# EAGLE design main (EAGLE 8.0.1)
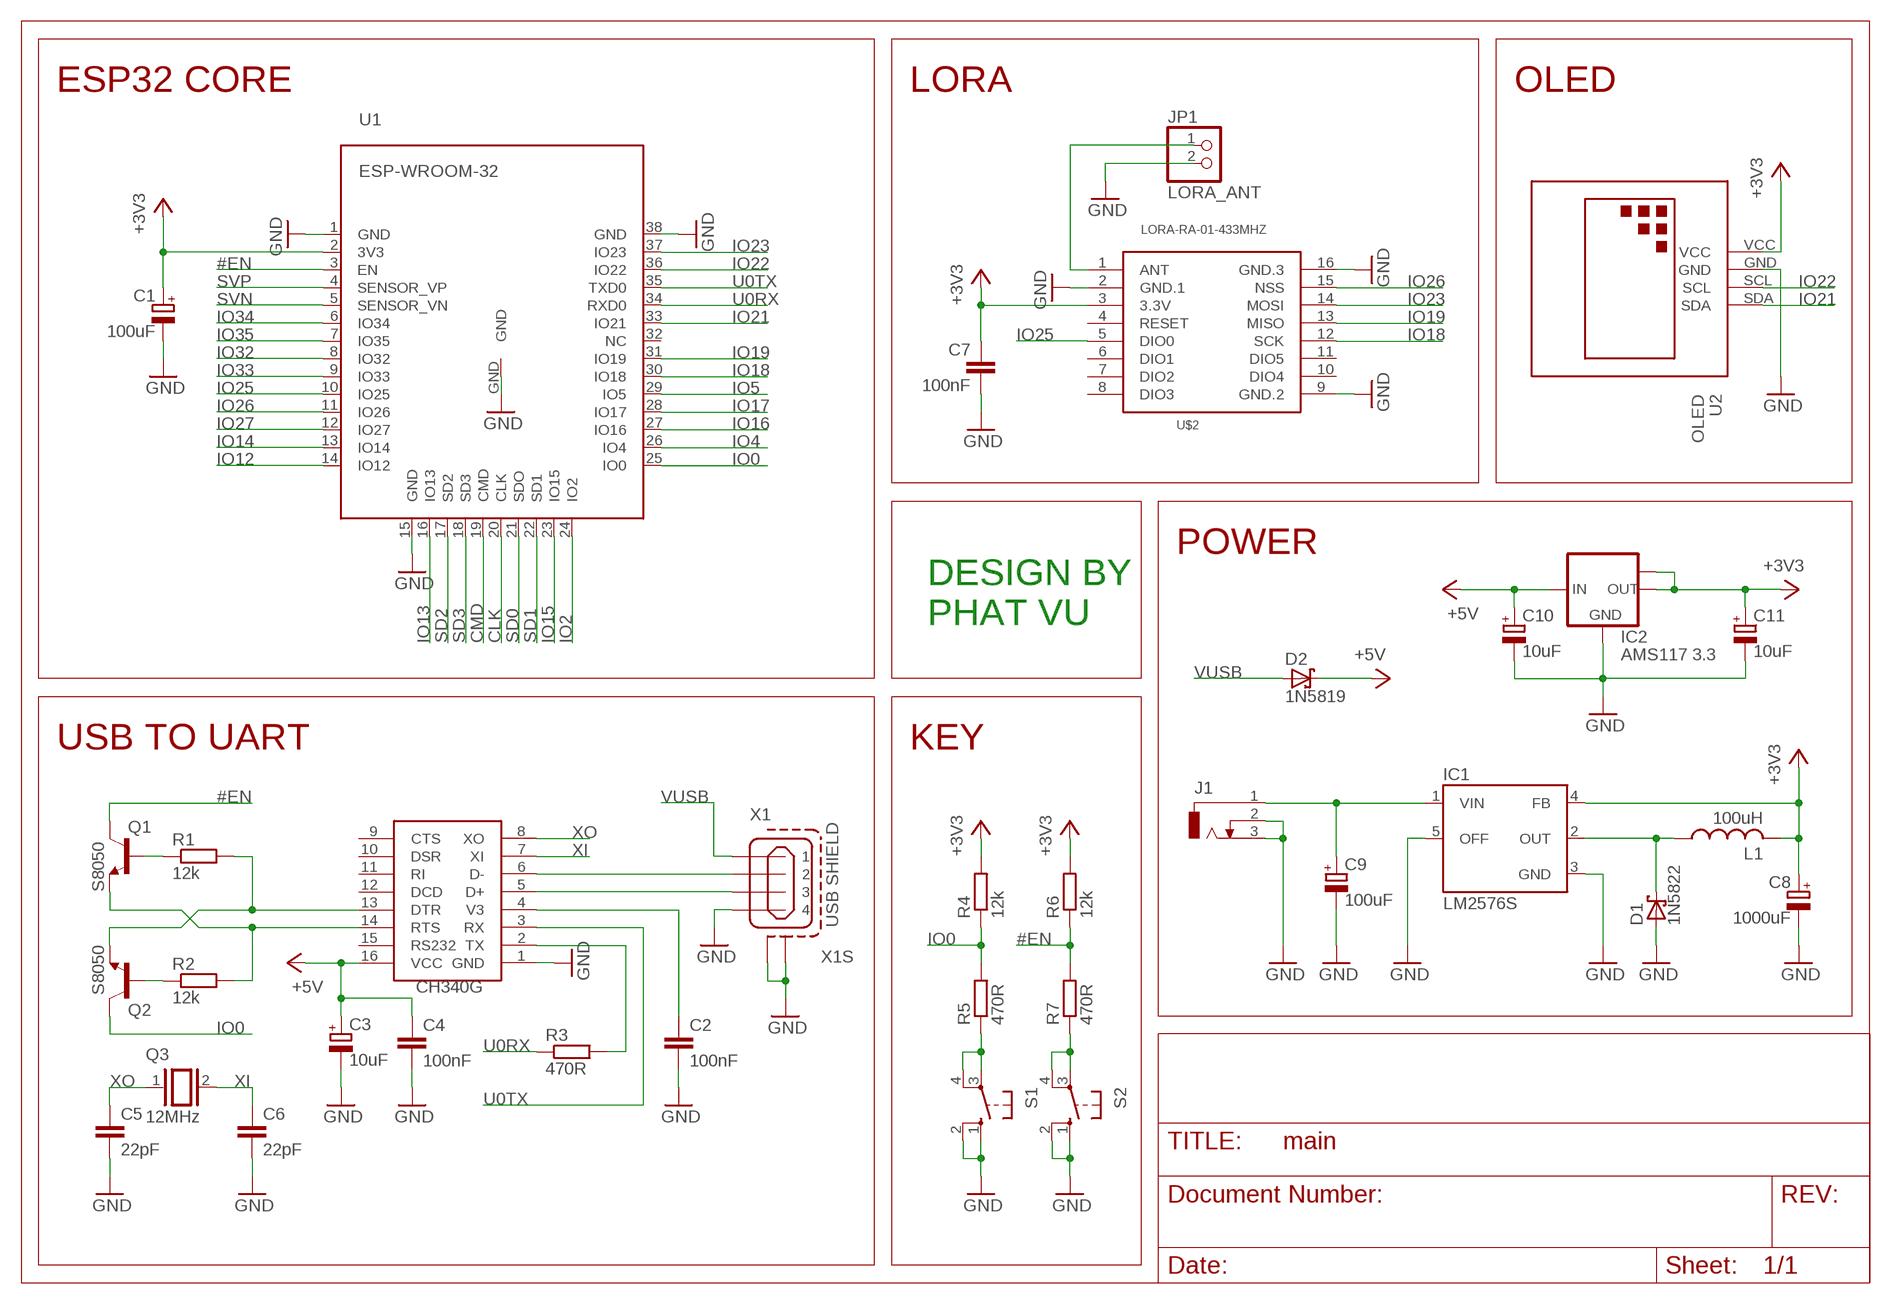
[diagram p0: schematic, sheet 1]

## Parts
C1  100uF  CPOL-EUE5-10.5  [E5-10,5]
C2  100nF  C-EU050-024X044  [C050-024X044]
C3  10uF  CPOL-EUE2.5-6  [E2,5-6]
C4  100nF  C-EU050-024X044  [C050-024X044]
C5  22pF  C-EU050-024X044  [C050-024X044]
C6  22pF  C-EU050-024X044  [C050-024X044]
C7  100nF  C-EU050-024X044  [C050-024X044]
C8  1000uF  CPOL-EUE5-13  [E5-13]
C9  100uF  CPOL-EUE5-10.5  [E5-10,5]
C10  10uF  CPOL-EUE2.5-6  [E2,5-6]
C11  10uF  CPOL-EUE2.5-6  [E2,5-6]
D1  1N5822  SCHOTTKY-DIODEDO201T15  [DO201T15]
D2  1N5819  1N5819-B  [DO41-7.6]
IC1  LM2576S  [TO263-5]
IC2  AMS117 3.3  LM1117MPX-3.3  [SOT223]
J1  DCJ0303  [DCJ0303]
JP1  LORA_ANT  PINHD-1X2  [1X02]
L1  100uH  L-US6000-XXX-RC  [6000-XXXX-RC]
Q1  S8050  S8050TO92  [TO92-EBC]
Q2  S8050  S8050TO92  [TO92-EBC]
Q3  12MHz  XTAL/S  [QS]
R1  12k  R-EU_0207/10  [0207/10]
R2  12k  R-EU_0207/10  [0207/10]
R3  470R  R-EU_0207/10  [0207/10]
R4  12k  R-EU_0207/10  [0207/10]
R5  470R  R-EU_0207/10  [0207/10]
R6  12k  R-EU_0207/10  [0207/10]
R7  470R  R-EU_0207/10  [0207/10]
S1  10-XX  [B3F-10XX]
S2  10-XX  [B3F-10XX]
U1  ESP-WROOM-32  [ESP-WROOM-32]
U2  OLED  OLED-096-I2C  [OLED-096-I2C]
U$1  CH340G  [SOIC16]
U$2  LORA-RA-01-433MHZ  [LORA-RA1-SMD]
X1  USB SHIELD  MINI-USB_SHIELD4P-85-32004-00X  [85-32004-00X]

## Nets
#EN: Q1.C R6.1 R7.2 U1.3(EN)
+3V3: C1.+ C7.1 C8.+ C11.+ IC1.4(FB) IC2.2(OUT) IC2.TAB(OUT1) L1.2 R4.2 R6.2 U1.2(3V3) U2.VCC U$2.3(3.3V)
+5V: C3.+ C4.1 C10.+ D2.C IC2.3(IN) U$1.16(VCC)
CLK: U1.20(CLK)
CMD: U1.19(CMD)
GND: C1.- C2.2 C3.- C4.2 C5.2 C6.2 C7.2 C8.- C9.- C10.- C11.- D1.A IC1.3(GND) IC1.5(OFF) IC2.1(GND) J1.2 J1.3 JP1.2 S1.1(S) S1.2(S1) S2.1(S) S2.2(S1) U1.1(GND) U1.15(GND) U1.38(GND) U1.GND U2.GND U$1.1(GND) U$2.2(GND.1) U$2.9(GND.2) U$2.16(GND.3) X1.4 X1.M1(S1) X1.M2(S2)
IO0: Q2.C R4.1 R5.2 U1.25(IO0)
IO2: U1.24(IO2)
IO4: U1.26(IO4)
IO5: U1.29(IO5)
IO12: U1.14(IO12)
IO13: U1.16(IO13)
IO14: U1.13(IO14)
IO15: U1.23(IO15)
IO16: U1.27(IO16)
IO17: U1.28(IO17)
IO18: U1.30(IO18) U$2.12(SCK)
IO19: U1.31(IO19) U$2.13(MISO)
IO21: U1.33(IO21) U2.SDA
IO22: U1.36(IO22) U2.SCL
IO23: U1.37(IO23) U$2.14(MOSI)
IO25: U1.10(IO25) U$2.5(DIO0)
IO26: U1.11(IO26) U$2.15(NSS)
IO27: U1.12(IO27)
IO32: U1.8(IO32)
IO33: U1.9(IO33)
IO34: U1.6(IO34)
IO35: U1.7(IO35)
N$1: JP1.1 U$2.1(ANT)
N$2: R3.2 U$1.2(TX)
N$3: U$1.6(D-) X1.2
N$4: U$1.5(D+) X1.3
N$5: C2.1 U$1.4(V3)
N$6: Q1.E R2.2 U$1.14(RTS)
N$7: Q2.E R1.2 U$1.13(DTR)
N$8: C9.+ IC1.1(VIN) J1.1
N$9: Q2.B R2.1
N$10: Q1.B R1.1
N$11: R7.1 S2.3(P) S2.4(P1)
N$12: R5.1 S1.3(P) S1.4(P1)
N$13: D1.C IC1.2(OUT) L1.1
SD0: U1.21(SDO)
SD1: U1.22(SD1)
SD2: U1.17(SD2)
SD3: U1.18(SD3)
SVN: U1.5(SENSOR_VN)
SVP: U1.4(SENSOR_VP)
U0RX: R3.1 U1.34(RXD0)
U0TX: U1.35(TXD0) U$1.3(RX)
VUSB: D2.A X1.1
XI: C6.1 Q3.2 U$1.7(XI)
XO: C5.1 Q3.1 U$1.8(XO)
Unconnected: U1.32(NC) U$1.9(CTS) U$1.10(DSR) U$1.11(RI) U$1.12(DCD) U$1.15(RS232) U$2.4(RESET) U$2.6(DIO1) U$2.7(DIO2) U$2.8(DIO3) U$2.10(DIO4) U$2.11(DIO5)

## Notes on the sheet
- ESP32 CORE | LORA | OLED
- POWER
- DESIGN BY
  PHAT VU
- USB TO UART | KEY

## Library data of the parts
C1 C3 C8-C11 = rcl:CPOL-EU: POLARIZED CAPACITOR, European symbol
C2 C4-C7 = rcl:C-EU: CAPACITOR, European symbol
D1 = diode:SCHOTTKY-DIODE: Schottky Diode
D2 = diode:1N581*: 1.0A SCHOTTKY BARRIER RECTIFIER Source: http://www.diodes.com/datasheets/ds23001.pdf
IC1 = lm2576:LM2576: National Semiconductor <http://www.national.com> 3.0A "Simple Switcher"(c) 52kHz, Vout 1.23-37V (HV: 57V), Vin 40V (HV: 60V), 50µA standby current
IC2 = lm1117:LM1117MPX-*
J1 = con-jack:DCJ0303: DC POWER JACK Source: DCJ0303.pdf; OC_FARNELL: unknown; OC_NEWARK: unknown
JP1 = pinhead:PINHD-1X2: PIN HEADER
L1 = rcl:L-US: INDUCTOR, American symbol
Q1 Q2 = s8050:S8050
Q3 = special:XTAL/S: CRYSTAL
R1-R7 = rcl:R-EU_: RESISTOR, European symbol
S1 S2 = switch-omron:10-XX: OMRON SWITCH; MPN: B3F-1000; OC_FARNELL: 176432; OC_NEWARK: 36M3542
U1 = esp32:ESP-WROOM-32
U2 = oled:OLED-096-I2C
U$1 = ch340g:CH340G
U$2 = lora:LORA-RA-01-433MHZ: 433 MHz Lora Ra-01 Radio Transceiver Module based on SX1278 chip.
X1 = con-cypressindustries:MINI-USB_SHIELD4P-: MINI USB 4 Pol. Source: www.cypressindustries.com; OC_FARNELL: unknown; OC_NEWARK: unknown

## Board
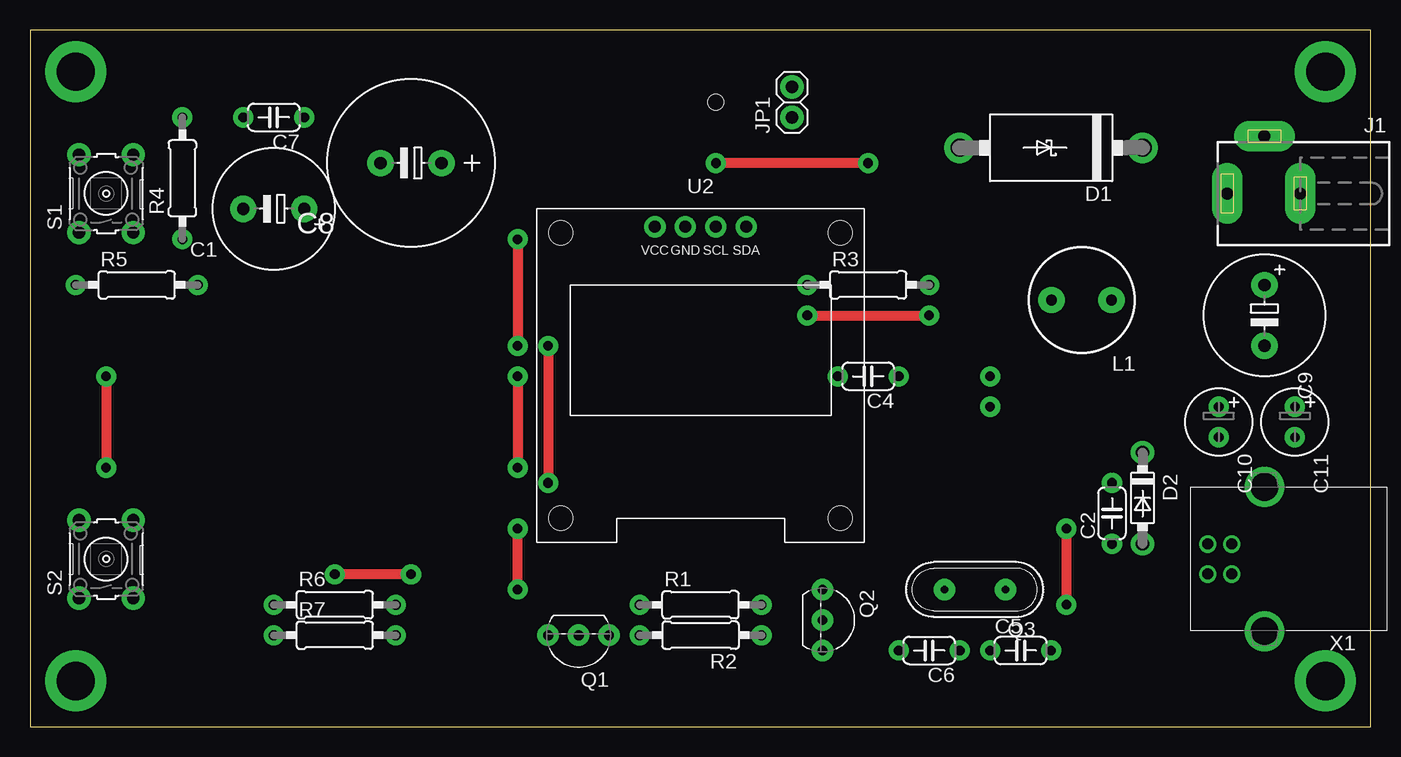
[diagram p1: board, top side]
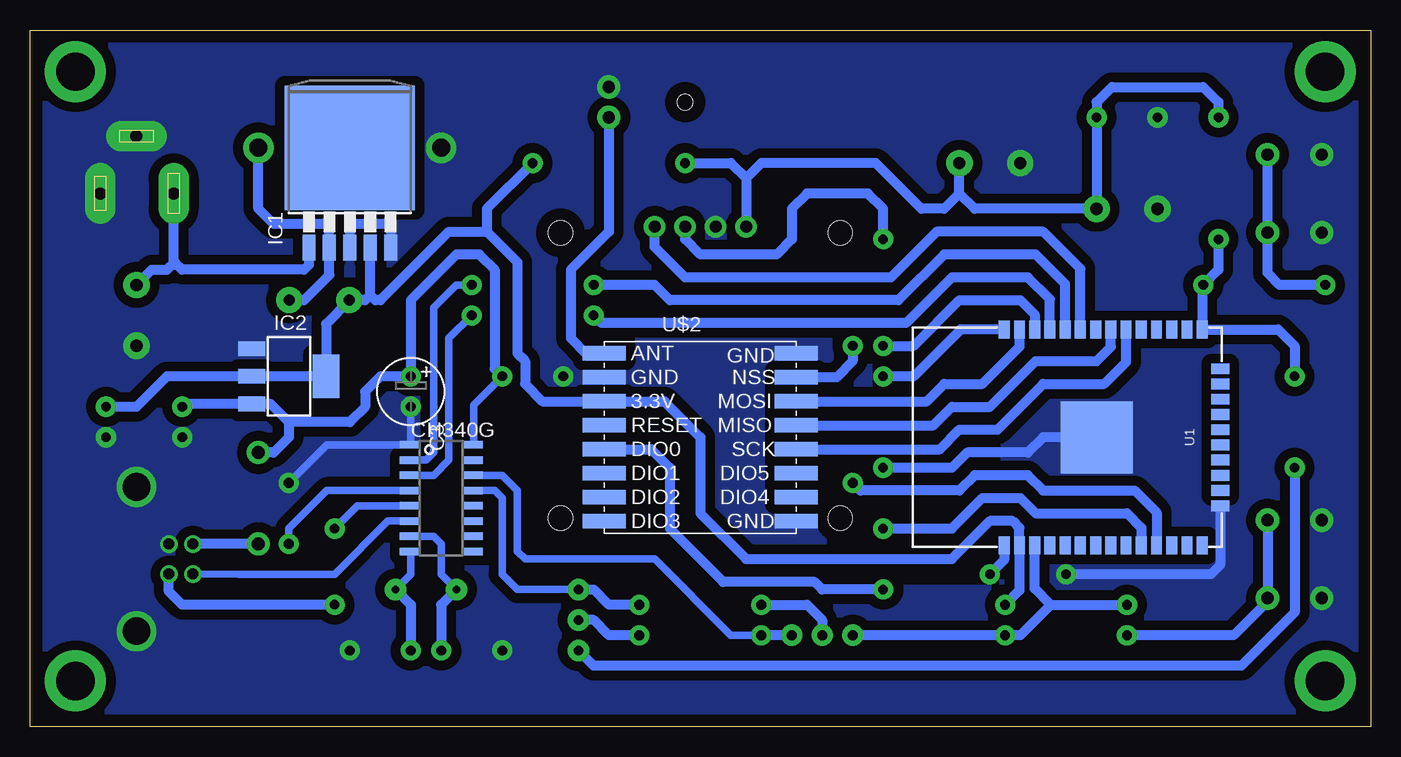
[diagram p2: board, bottom side, seen from below]

Size 111.74 x 58.09 mm. Coordinates in mm from the lower left corner, seen from the top.
Outline: 0,0 111.74,0 111.74,58.09 0,58.09 0,0
Copper layers (1*16): Top 0.035mm / dielectric 1.5mm / Bottom 0.035mm
Design rules "default": minimum track width 10mil, minimum drill 24mil, track to track 8mil, track to pad 8mil, pad to pad 8mil, via to via 8mil, smd to smd 8mil, copper to edge 40mil, drill to drill 8mil, minimum pad ring 10mil, minimum via ring 8mil, stop-mask expansion 4mil, vias tented up to drill 0mil, thermal gap 10mil
Holes 1.3 mm at 57.15,52.07

### Footprints (pad centres in the part's own frame; a part is rotated, then mirrored left to right if it is on the bottom)
E5-10,5 = drill 1.016 pad 2.184: + -2.54,0; - 2.54,0
C050-024X044 = drill 0.813 pad 1.676: 1 -2.54,0; 2 2.54,0
E2,5-6 = drill 0.813 pad 1.676: + -1.27,0; - 1.27,0
E5-13 = drill 1.016 pad 2.184: + -2.54,0; - 2.54,0
DO201T15 = drill 1.499 pad 2.54: A 7.62,0; C -7.62,0
DO41-7.6 = drill 1.1 pad 1.93: A 3.81,0; C -3.81,0
TO263-5 = smd 1.067 x 2.159: 1 -3.404,-5.791; 2 -1.702,-5.791; 3 0,-5.791; 4 1.702,-5.791; 5 3.404,-5.791 | smd 10.8 x 10.41: 6 0,2.54
SOT223 = smd 1.219 x 2.235: 1 -2.311,-3.099; 2 0,-3.099; 3 2.311,-3.099 | smd 3.6 x 2.2: TAB 0,3.099
DCJ0303 = drill 1 pad 2.54 long: 1 0,3.1; 2 4.8,0; 3 0,-3
1X02 = drill 1.016 pad 1.93: 1 -1.27,0; 2 1.27,0
6000-XXXX-RC = drill 0.9 pad 2.184: 1 -2.5,0; 2 2.5,0
TO92-EBC = drill 0.813 pad 1.778: B 0,-1.27; C 2.54,-1.27; E -2.54,-1.27
QS = drill 0.61 pad 1.778: 1 -2.54,0; 2 2.54,0
0207/10 = drill 0.813 pad 1.676: 1 -5.08,0; 2 5.08,0
B3F-10XX = drill 1.016 pad 1.93: 1 -3.251,2.261; 2 3.251,2.261; 3 -3.251,-2.261; 4 3.251,-2.261
ESP-WROOM-32 = smd 0.9 x 1.5: 1 7.7,9; 2 6.43,9; 3 5.16,9; 4 3.89,9; 5 2.62,9; 6 1.35,9; 7 0.08,9; 8 -1.19,9; 9 -2.46,9; 10 -3.73,9; 11 -5,9; 12 -6.27,9; 13 -7.54,9; 14 -8.81,9; 25 -8.81,-9; 26 -7.54,-9; 27 -6.27,-9; 28 -5,-9; 29 -3.73,-9; 30 -2.46,-9; 31 -1.19,-9; 32 0.08,-9; 33 1.35,-9; 34 2.62,-9; 35 3.89,-9; 36 5.16,-9; 37 6.43,-9; 38 7.7,-9 | smd 1.5 x 0.9: 15 -10.3,5.715; 16 -10.3,4.445; 17 -10.3,3.175; 18 -10.3,1.905; 19 -10.3,0.635; 20 -10.3,-0.635; 21 -10.3,-1.905; 22 -10.3,-3.175; 23 -10.3,-4.445; 24 -10.3,-5.715 | smd 6 x 6: GND 0,0
OLED-096-I2C = drill 1 pad 1.778: GND -1.27,9.93; SCL 1.27,9.93; SDA 3.81,9.93; VCC -3.81,9.93 | hole 2: -11.65,9.43; 11.65,9.43; -11.65,-14.37; 11.65,-14.37
SOIC16 = smd 0.635 x 1.524: 1 -4.445,-2.695; 2 -3.175,-2.695; 3 -1.905,-2.695; 4 -0.635,-2.695; 5 0.635,-2.695; 6 1.905,-2.695; 7 3.175,-2.695; 8 4.445,-2.695; 9 4.445,2.695; 10 3.175,2.695; 11 1.905,2.695; 12 0.635,2.695; 13 -0.635,2.695; 14 -1.905,2.695; 15 -3.175,2.695; 16 -4.445,2.695
LORA-RA1-SMD = smd 3.6 x 1.2: 1 -8,7; 2 -8,5; 3 -8,3; 4 -8,1; 5 -8,-1; 6 -8,-3; 7 -8,-5; 8 -8,-7; 9 8,-7; 10 8,-5; 11 8,-3; 12 8,-1; 13 8,1; 14 8,3; 15 8,5; 16 8,7
85-32004-00X = drill 0.92 pad 1.422: 1 4.71,-1.25; 2 4.71,1.25; 3 2.71,1.25; 4 2.71,-1.25 | drill 2.3 pad 3: M1 0,6.02; M2 0,-6.02

### Placement (x,y rotation side)
C1  20.32,43.18 180 top
C2  90.17,17.78 90 top
C3  80.01,27.94 270 bottom
C4  69.85,29.21 180 top
C5  82.55,6.35 0 top
C6  74.93,6.35 180 top
C7  20.32,50.8 180 top
C8  31.75,46.99 180 top
C9  102.87,34.29 270 top
C10  99.06,25.4 270 top
C11  105.41,25.4 270 top
D1  85.09,48.26 180 top
D2  92.71,19.05 270 top
IC1  85.09,45.72 0 bottom
IC2  90.17,29.21 270 bottom
J1  102.87,44.45 90 top
JP1  63.5,52.07 90 top
L1  87.63,35.56 180 top
Q1  45.72,6.35 180 top
Q2  67.31,8.89 270 top
Q3  78.74,11.43 180 top
R1  55.88,10.16 0 top
R2  55.88,7.62 180 top
R3  69.85,36.83 0 top
R4  12.7,45.72 90 top
R5  8.89,36.83 0 top
R6  25.4,10.16 0 top
R7  25.4,7.62 0 top
S1  6.35,44.45 90 top
S2  6.35,13.97 90 top
U1  22.86,24.13 180 bottom
U2  55.88,31.75 0 top
U$1  77.47,19.05 270 bottom
U$2  55.88,24.13 0 bottom
X1  102.87,13.97 180 top

### Tracks (layer width: path | path; a pad name or v marks a point on that pad's centre or on a via)
#EN
  Bottom 0.813: 26.67,10.16 29.21,7.62 R7.2 Q1.C | 26.67,10.16 R6.1 | 26.67,10.16 28.02,11.51 U1.3
+3V3  (via drill 0.8 pad 1.68)
  Top 0.813: v69.85,46.99 v57.15,46.99
  Bottom 0.813: R6.2 29.29,11.35 U1.2 29.29,16.59 29.84,17.14 31.75,17.14 34.92,13.97 52.07,13.97 55.88,17.78 55.88,24.13 58.88,27.13 U$2.3 69.04,27.13 70.48,28.57 70.48,30.48 71.12,31.12 71.12,38.73 73.66,41.27 | 73.66,41.27 76.83,41.27 82.55,35.56 82.96,35.56 83.39,35.99 | 83.39,35.99 IC1.4 | 83.39,35.99 83.82,35.56 L1.2 85.13,35.52 87.07,33.58 IC2.TAB IC2.2 100.33,29.21 102.87,26.67 C11.+ | 34.29,44.45 33.02,43.18 C1.+ C7.1 22.86,52.07 21.59,53.34 13.97,53.34 12.7,52.07 R4.2 | 34.29,44.45 C8.+ | 34.29,44.45 35.56,43.18 37.47,43.18 41.27,46.99 50.8,46.99 52.07,45.72 | 52.07,45.72 U2.VCC | v57.15,46.99 53.34,46.99 52.07,45.72 | v69.85,46.99 73.66,43.18 73.66,41.27
+5V
  Bottom 0.61: C4.1 74.77,26.82 U$1.16
  Bottom 0.813: 90.17,25.4 85.09,25.4 83.82,26.67 83.82,27.94 82.55,29.21 C3.+ 80.01,35.56 76.2,39.37 74.3,39.37 73.03,38.1 73.03,29.84 C4.1 | 90.17,25.4 91.67,26.9 IC2.3 98.83,26.9 C10.+ | 90.17,25.4 90.17,24.13 91.44,22.86 D2.C
GND  (via drill 0.8 pad 1.68)
  Top 0.813: v31.75,12.7 v25.4,12.7 | v40.64,29.21 v40.64,21.59
  Bottom 0.61: C3.- 80.01,23.65 U$1.1 86.99,23.5 C2.2
  Bottom 0.813: IC1.5 81.69,41.91 85.09,41.91 IC1.3 | U1.1 30.56,13.89 v31.75,12.7 | U1.15 12.56,13.47 13.34,12.7 v25.4,12.7 | 21.59,24.13 20.32,24.13 | U1.38 34.18,33.13 38.1,29.21 v40.64,29.21 | 22.86,22.86 21.59,24.13 | v40.64,21.59 34.92,21.59 33.66,22.86 28.57,22.86 27.3,24.13 U1.GND 21.59,24.13
  pour Bottom (isolate 0.813, no thermals): 0,58.42 111.76,58.42 111.76,0 0,0
IO0  (via drill 0.8 pad 1.68)
  Top 0.813: v6.35,29.21 v6.35,21.59
  Bottom 0.813: v6.35,29.21 6.35,31.75 7.73,33.13 U1.25 14.05,36.75 R5.2 12.7,38.1 R4.1 | Q2.C 64.77,5.08 10.79,5.08 6.35,9.53 v6.35,21.59
IO18
  Bottom 0.813: U1.30 20.4,30.4 22.23,28.57 27.3,28.57 31.11,24.77 34.29,24.77 35.92,23.13 U$2.12
IO19
  Bottom 0.813: U1.31 21.67,31.67 22.86,30.48 27.94,30.48 31.75,26.67 34.92,26.67 36.47,25.13 U$2.13
IO21
  Bottom 0.813: U1.33 24.21,38.18 27.3,41.27 36.2,41.27 40,37.47 57.15,37.47 59.69,40 U2.SDA
IO22  (via drill 0.8 pad 1.68)
  Top 0.813: v40.64,40.64 v40.64,31.75
  Bottom 0.813: U2.SCL 57.15,40.64 55.88,39.37 49.53,39.37 48.26,40.64 48.26,43.18 46.99,44.45 41.91,44.45 40.64,43.18 v40.64,40.64 | v40.64,31.75 38.1,31.75 34.29,35.56 29.21,35.56 28.02,34.37 U1.36
IO23
  Bottom 0.813: U1.37 29.29,31.67 32.39,28.57 35.56,28.57 37,27.13 U$2.14
IO25  (via drill 0.8 pad 1.68)
  Top 0.813: v40.64,11.43 v40.64,16.51
  Bottom 0.813: U$2.5 59.96,23.13 58.42,21.59 58.42,16.51 53.97,12.06 46.36,12.06 45.72,11.43 v40.64,11.43 | v40.64,16.51 34.92,16.51 32.39,19.05 29.21,19.05 27.94,17.78 20.32,17.78 19.13,16.59 U1.10
IO26  (via drill 0.8 pad 1.68)
  Top 0.813: v43.18,31.75 v43.18,20.32
  Bottom 0.813: U1.11 17.86,17.86 19.69,19.68 27.3,19.68 28.57,20.95 33.02,20.95 34.29,19.68 42.55,19.68 v43.18,20.32 | v43.18,31.75 43.18,30.48 44.53,29.13 U$2.15
N$1
  Bottom 0.813: JP1.1 63.5,41.27 66.67,38.1 66.67,32.38 65.42,31.13 U$2.1
N$2
  Bottom 0.61: U$1.2 78.74,22.23 78.1,22.86 78.1,34.92 76.2,36.83 R3.2
N$3
  Bottom 0.61: U$1.6 81.91,17.14 86.36,12.7 94.33,12.7 X1.2
N$4  (via drill 0.8 pad 1.68)
  Top 0.813: v86.36,16.51 v86.36,10.16
  Bottom 0.61: U$1.5 84.45,18.41 v86.36,16.51
  Bottom 0.813: v86.36,10.16 99.06,10.16 100.16,11.26 X1.3
N$5
  Bottom 0.61: U$1.4 86.99,19.68 90.17,16.51 C2.1
N$6
  Bottom 0.61: R2.2 53.34,7.62 59.69,13.97 70.48,13.97 71.12,14.61 71.12,19.68 72.39,20.95 U$1.14
  Bottom 0.813: Q1.E R2.2
N$7
  Bottom 0.61: U$1.13 73.03,19.68 72.39,19.05 72.39,12.7 71.12,11.43 Q2.E
  Bottom 0.813: R1.2 63.5,10.16 64.77,11.43 Q2.E
N$8
  Bottom 0.813: IC1.1 88.49,38.51 88.9,38.1 99.06,38.1 99.62,38.66 99.77,38.66 | C9.+ 101.6,38.1 100.33,38.1 99.77,38.66 | 99.77,38.66 J1.1
N$9
  Bottom 0.813: R2.1 63.5,7.62 64.77,8.89 Q2.B
N$10
  Bottom 0.813: R1.1 46.99,10.16 45.72,8.89 Q1.B
N$11
  Bottom 0.813: S2.4 S2.3 8.61,10.44 11.43,7.62 R7.1
N$12
  Bottom 0.813: R5.1 7.62,36.83 8.61,37.82 S1.3 S1.4
N$13
  Bottom 0.813: L1.1 88.9,35.56 86.79,37.67 IC1.2 86.79,41.71 86.99,41.91 91.44,41.91 92.71,43.18 D1.C
N$14  (via drill 3.2 pad 5.08)
  other vias: 3.81,3.81
N$15  (via drill 3.2 pad 5.08)
  other vias: 3.81,54.61
N$16  (via drill 3.2 pad 5.08)
  other vias: 107.95,54.61
N$17  (via drill 3.2 pad 5.08)
  other vias: 107.95,3.81
U0RX
  Bottom 0.813: U1.34 25.48,36.91 27.94,39.37 35.56,39.37 39.37,35.56 58.42,35.56 59.69,36.83 R3.1
U0TX  (via drill 0.8 pad 1.68)
  Top 0.813: v64.77,34.29 v74.93,34.29
  Bottom 0.61: U$1.3 78.1,20.95 76.83,22.23 76.83,32.38 v74.93,34.29
  Bottom 0.813: U1.35 26.75,35.64 28.57,37.47 34.92,37.47 38.73,33.66 64.14,33.66 v64.77,34.29
VUSB
  Bottom 0.813: D2.A 92.73,15.22 X1.1
XI
  Bottom 0.61: U$1.7 78.1,15.88 77.47,15.24 77.47,12.7 Q3.2
  Bottom 0.813: Q3.2 77.47,10.16 C6.1
XO
  Bottom 0.61: U$1.8 80.01,14.45 80.01,12.7 Q3.1
  Bottom 0.813: Q3.1 80.01,10.16 C5.1